# Altium project Placa.PrjPcb
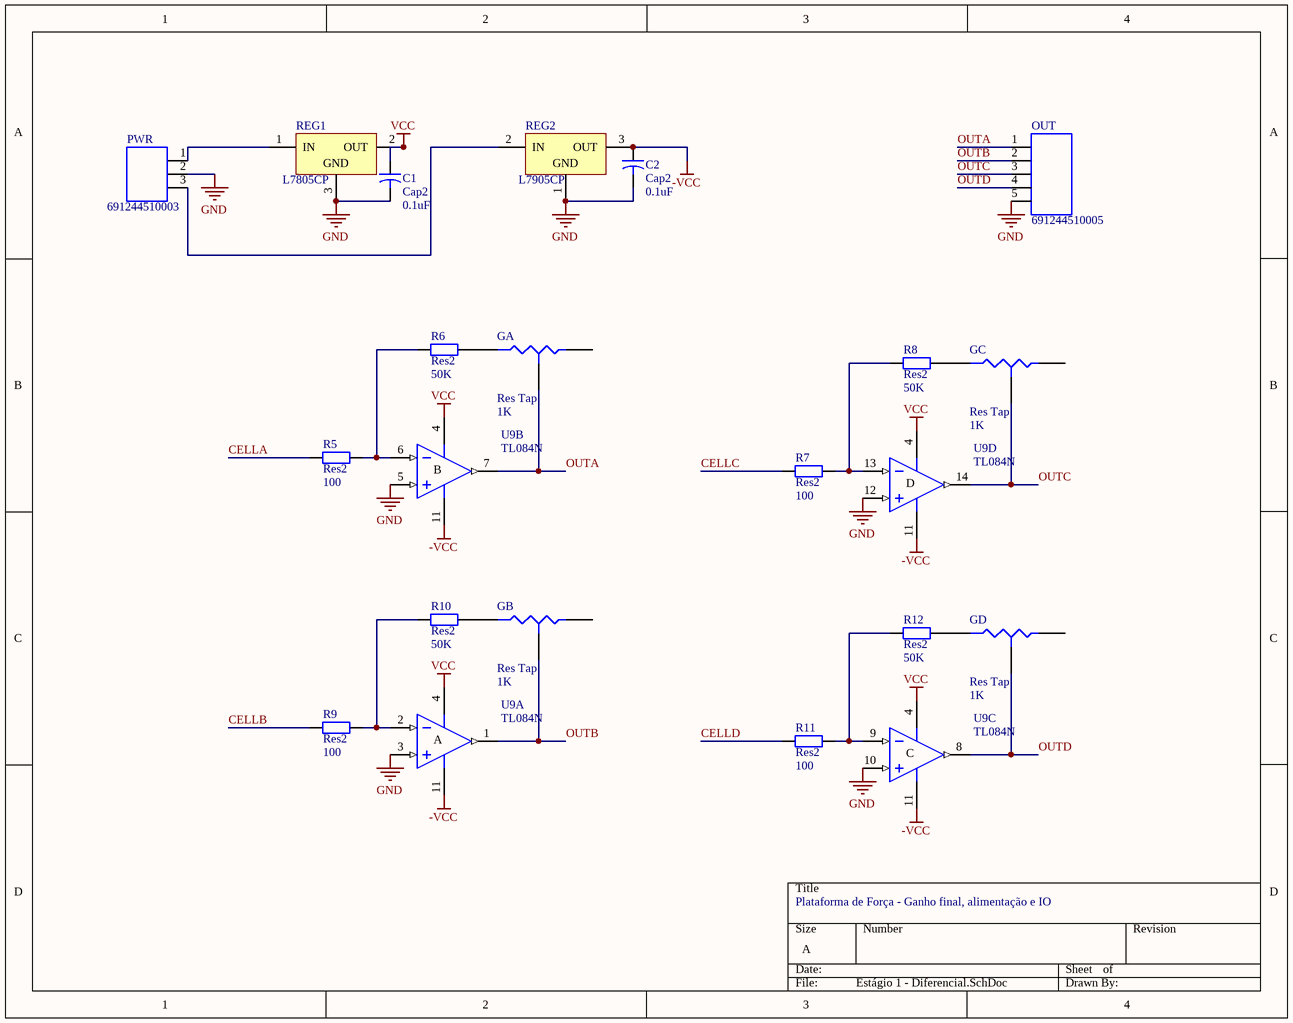
[diagram p0: Estágio 1 - Diferencial.SchDoc]
5 sheets, 43 parts. Net scope: global (net labels, ports and power ports of the same name join across sheets).
Board file: Placa.PcbDoc
Sheets:
  Estágio 1 - Diferencial.SchDoc
  Célula 1.SchDoc
  Célula 2.SchDoc
  Célula 3.SchDoc
  Célula 4.SchDoc

## Sheet Estágio 1 - Diferencial.SchDoc
size A

### Parts
C1  Cap2  value 0.1uF  [CAPR5-4X5]
C2  Cap2  value 0.1uF  [CAPR5-4X5]
GA  Res Tap  value 1K  [3296W]
GB  Res Tap  value 1K  [3296W]
GC  Res Tap  value 1K  [3296W]
GD  Res Tap  value 1K  [3296W]
OUT  691244510005  [691244510005]
PWR  691244510003  [691244510003]
R5  Res2  value 100  [AXIAL-0.4]
R6  Res2  value 50K  [AXIAL-0.4]
R7  Res2  value 100  [AXIAL-0.4]
R8  Res2  value 50K  [AXIAL-0.4]
R9  Res2  value 100  [AXIAL-0.4]
R10  Res2  value 50K  [AXIAL-0.4]
R11  Res2  value 100  [AXIAL-0.4]
R12  Res2  value 50K  [AXIAL-0.4]
REG1  L7805CP  [ISOWATT220AB]
REG2  L7905CP  [ISOWATT220AB]
U9  TL084N  [N014]  (parts A,B,C,D of 4)

### Nets
-VCC: C2.1 REG2.3(OUT) U9.11(V-)
GND: C1.2 C2.2 OUT.5 PWR.2 REG1.3(GND) REG2.1(GND) U9.3(IN+) U9.5(IN+) U9.10(IN+) U9.12(IN+)
VCC: C1.1 REG1.2(OUT) U9.4(V+)
CELLA: R5.1
CELLB: R9.1
CELLC: R7.1
CELLD: R11.1
OUTA: GA.3(TAP) OUT.1 U9.7(OUT)
OUTB: GB.3(TAP) OUT.2 U9.1(OUT)
OUTC: GC.3(TAP) OUT.3 U9.14(OUT)
OUTD: GD.3(TAP) OUT.4 U9.8(OUT)
NetGA_2: GA.2(B) R6.2
NetGB_2: GB.2(B) R10.2
NetGC_2: GC.2(B) R8.2
NetGD_2: GD.2(B) R12.2
NetPWR_1: PWR.1 REG1.1(IN)
NetPWR_3: PWR.3 REG2.2(IN)
NetR5_2: R5.2 R6.1 U9.6(IN-)
NetR7_2: R7.2 R8.1 U9.13(IN-)
NetR9_2: R9.2 R10.1 U9.2(IN-)
NetR11_2: R11.2 R12.1 U9.9(IN-)

Not connected (* = marked no-connect by the designer): GA 1(A); GB 1(A); GC 1(A); GD 1(A)

### Notes on the sheet
- Plataforma de Força - Ganho final, alimentação e IO
- (in symbol TL084N, part A) A
- (in symbol TL084N, part B) B
- (in symbol TL084N, part C) C
- (in symbol TL084N, part D) D

### Library data of the parts
C1 C2 = Cap2: Capacitor; Published: 23-Sep-2002; PackageReference: CAPR5-4X5; Publisher: Altium Limited; PackageDescription: Capacitor; 2 Leads
GA GB GC GD = Res Tap: Tapped Resistor; Sim Note: Enter the Resistance value and the set point into parameter fields.; Set Position: 0.5; Published: 24-Mar-1999; LatestRevisionDate: 17-Jul-2002; LatestRevisionNote: Re-released for DXP Platform.; PackageReference: VR3; Publisher: Altium Limited; PackageDescription: Variable Resistor, Thru-Hole; 3 Leads
OUT = 691244510005: WR-TBL Horizontal Cable Entry With Rising Cage Clamp,Serie 2445 - 5.08 mm; Manufacturer: Wurth Elektronik; ComponentLink1 Description: Manufacturer; ComponentLink2 Description: Datasheet; ComponentLink1URL: http://www.we-online.de; ComponentLink2URL: http://katalog.we-online.de/em/datasheet/6912445100XX.pdf; Created by: Baojun Chen; Created Date: 15.Sep.2015; partNo: 691244510005
PWR = 691244510003: WR-TBL Horizontal Cable Entry With Rising Cage Clamp,Serie 2445 - 5.08 mm; Manufacturer: Wurth Elektronik; ComponentLink1 Description: Manufacturer; ComponentLink2 Description: Datasheet; ComponentLink1URL: http://www.we-online.de; ComponentLink2URL: http://katalog.we-online.de/em/datasheet/6912445100XX.pdf; Created by: Baojun Chen; Created Date: 15.Sep.2015; partNo: 691244510003
R5-R12 = Res2: Resistor; Published: 8-Jun-2000; LatestRevisionDate: 17-Jul-2002; LatestRevisionNote: Re-released for DXP Platform.; PackageReference: AXIAL-0.4; Publisher: Altium Limited; PackageDescription: Axial Device, Thru-Hole; 2 Leads; 0.4 in Pin Spacing
REG1 = L7805CP: Positive Voltage Regulator; Note: Tab is connected to pin 3 (GND).; Published: 24-Aug-2001; LatestRevisionDate: 17-Jul-2002; LatestRevisionNote: Re-released for DXP Platform.; DatasheetVersion: Dec-1998; PackageVersion: Jul-1998; PackageReference: ISOWATT220AB; Publisher: Altium Limited; PackageDescription: TO, Thru-Hole, Vertical, Heatsink Mounted; 3 In-Line Leads; Pitch 2.54 mm; Pin sequence 1, 3, 2; ComponentLink1Description: Manufacturer Link; ComponentLink1URL: http://www.st.com/
REG2 = L7905CP: Negative Voltage Regulator; Note: Tab is connected to pin 3 (IN).; Published: 24-Aug-2001; LatestRevisionDate: 17-Jul-2002; LatestRevisionNote: Re-released for DXP Platform.; DatasheetVersion: Apr-1997; PackageVersion: Jul-1998; PackageReference: ISOWATT220AB; Publisher: Altium Limited; PackageDescription: TO, Thru-Hole, Vertical, Heatsink Mounted; 3 In-Line Leads; Pitch 2.54 mm; Pin sequence 1, 3, 2; ComponentLink1Description: Manufacturer Link; ComponentLink1URL: http://www.st.com/; ComponentLink2Description: Datasheet; ComponentLink2URL: http://www.st.com/stonline/products/literature/ds/2149/l7905c.pdf
U9 = TL084N: JFET-Input Operational Amplifier; Published: 16-Jan-2001; LatestRevisionDate: 04-Mar-2005; LatestRevisionNote: Stylized 3D Model Added.; DatasheetVersion: Feb-1999; PackageVersion: Oct-1995; PackageReference: N014; Publisher: Altium Limited; PackageDescription: DIP; 14 Leads; Row Spacing 7.62 mm; Pitch 2.54 mm; ComponentLink1Description: Manufacturer Link; ComponentLink1URL: http://www.ti.com/; ComponentLink2Description: Datasheet; ComponentLink2URL: http://www-s.ti.com/sc/ds/tl084.pdf

## Sheet Célula 1.SchDoc
size A
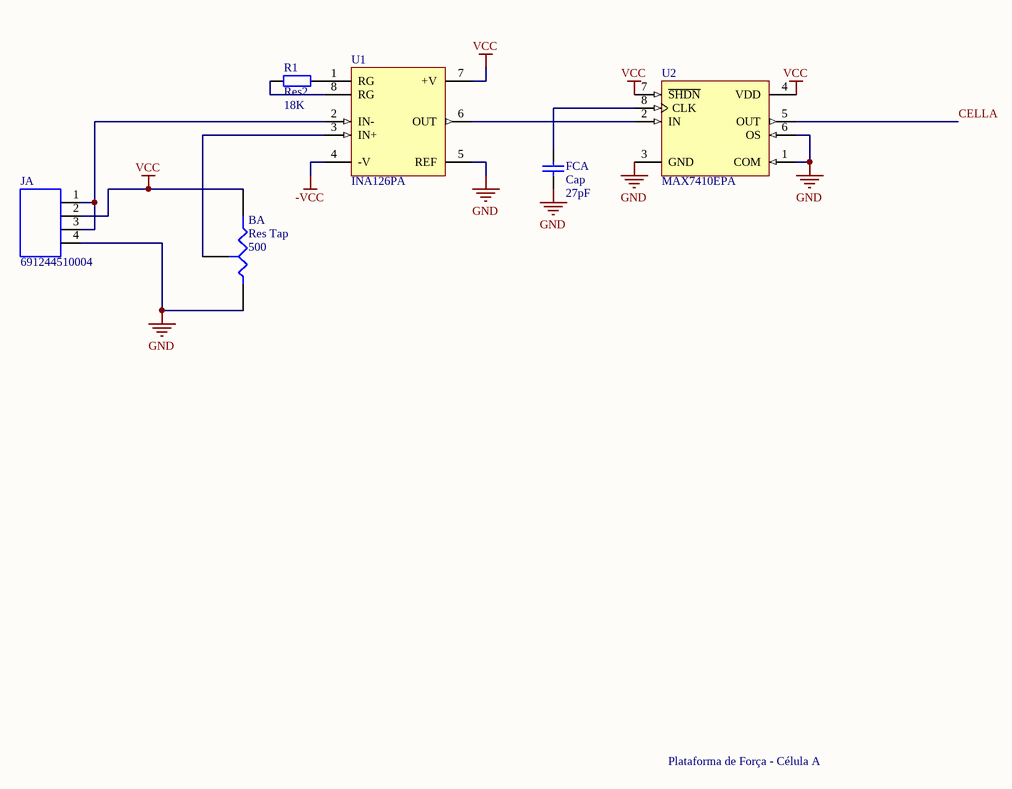
[diagram p1: Célula 1.SchDoc]

### Parts
BA  Res Tap  value 500  [TSR3006]
FCA  Cap  value 27pF  [RAD-0.3]
JA  691244510004  [691244510004]
R1  Res2  value 18K  [AXIAL-0.4]
U1  INA126PA  [006E]
U2  MAX7410EPA  [PA8]

### Nets
-VCC: U1.4(-V)
GND: BA.1(A) FCA.1 JA.4 U1.5(REF) U2.1(COM) U2.3(GND) U2.6(OS)
VCC: BA.2(B) JA.2 U1.7(+V) U2.4(VDD) U2.7(~{SHDN})
CELLA: U2.5(OUT)
NetBA_3: BA.3(TAP) U1.3(IN+)
NetFCA_2: FCA.2 U2.8(CLK)
NetJA_1: JA.1 JA.3 U1.2(IN-)
NetR1_1: R1.1 U1.8(RG)
NetR1_2: R1.2 U1.1(RG)
NetU1_6: U1.6(OUT) U2.2(IN)

### Notes on the sheet
- Plataforma de Força - Célula A

### Library data of the parts
BA = Res Tap: as GA on sheet Estágio 1 - Diferencial; Published: 24-Mar-1999; LatestRevisionDate: 17-Jul-2002; LatestRevisionNote: Re-released for DXP Platform.; PackageReference: VR3; Publisher: Altium Limited; PackageDescription: Variable Resistor, Thru-Hole; 3 Leads
FCA = Cap: Capacitor; Published: 8-Jun-2000; LatestRevisionDate: 17-Jul-2002; LatestRevisionNote: Re-released for DXP Platform.; PackageReference: RAD-0.3; Publisher: Altium Limited; PackageDescription: Radial Cap, Thru-Hole; 2 Leads; 0.3 in Pin Spacing
JA = 691244510004: WR-TBL Horizontal Cable Entry With Rising Cage Clamp,Serie 2445 - 5.08 mm; Manufacturer: Wurth Elektronik; ComponentLink1 Description: Manufacturer; ComponentLink2 Description: Datasheet; ComponentLink1URL: http://www.we-online.de; ComponentLink2URL: http://katalog.we-online.de/em/datasheet/6912445100XX.pdf; Created by: Baojun Chen; Created Date: 15.Sep.2015; partNo: 691244510004
R1 = Res2: Resistor; Published: 8-Jun-2000; LatestRevisionDate: 17-Jul-2002; LatestRevisionNote: Re-released for DXP Platform.; PackageReference: AXIAL-0.4; Publisher: Altium Limited; PackageDescription: Axial Device, Thru-Hole; 2 Leads; 0.4 in Pin Spacing
U1 = INA126PA: Precision, Low-Power Instrumentation Amplifiers; Published: 8-Jun-2000; LatestRevisionDate: 06-Jun-2005; LatestRevisionNote: Stylized 3D Model Added.; DatasheetVersion: Oct-1996; PackageVersion: revE; PackageReference: 006E; Publisher: Altium Limited; PackageDescription: DIP; 8 Leads; Row Spacing 7.62 mm; Pitch 2.54 mm; ComponentLink1Description: Manufacturer Link; ComponentLink1URL: http://www.ti.com/; ComponentLink2Description: Datasheet; ComponentLink2URL: http://www-s.ti.com/sc/ds/INA128.pdf
U2 = MAX7410EPA: 5th-Order, Lowpass, Switched-Capacitor Filter; Published: 16-Jan-2001; LatestRevisionDate: 29-May-2009; LatestRevisionNote: Component Body Added.; DatasheetVersion: Sep-1998; PackageVersion: RevB, 21-0043; PackageReference: PA8; Publisher: Altium Limited; PackageDescription: DIP, 8-Pin, Row Spacing 7.62 mm, Pitch 2.54 mm; Code_JEDEC: MS-001-AB; ComponentLink1Description: Manufacturer Link; ComponentLink1URL: http://www.maxim-ic.com/; ComponentLink2Description: Datasheet; ComponentLink2URL: http://pdfserv.maxim-ic.com/en/ds/MAX7409-MAX7414.pdf

## Sheet Célula 2.SchDoc
size A
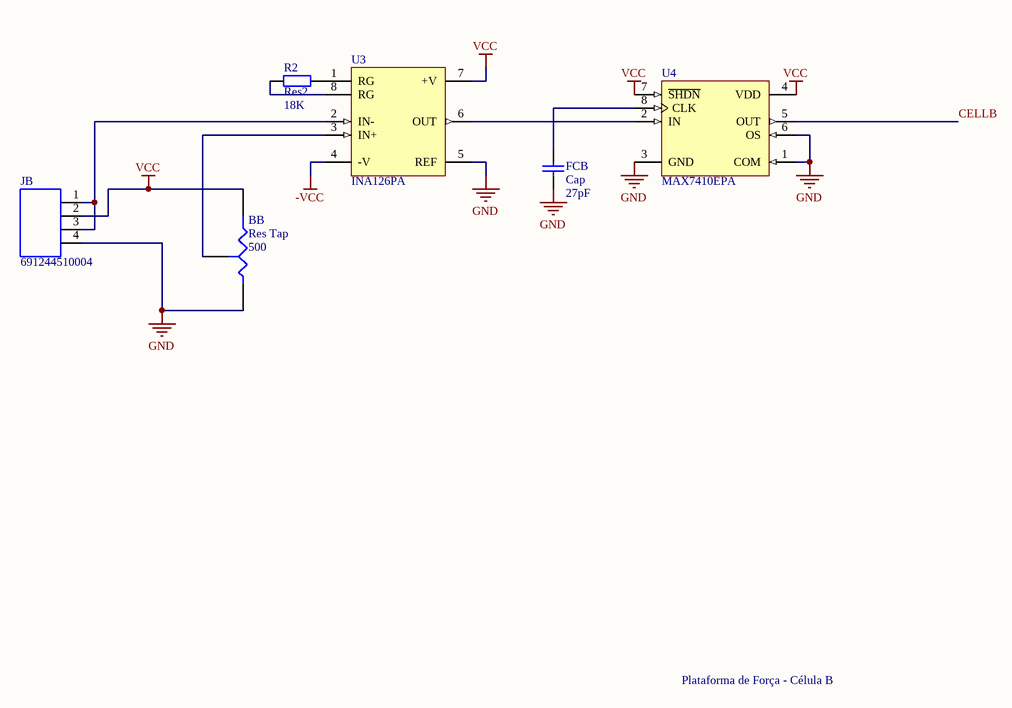
[diagram p2: Célula 2.SchDoc]

### Parts
BB  Res Tap  value 500  [TSR3006]
FCB  Cap  value 27pF  [RAD-0.3]
JB  691244510004  [691244510004]
R2  Res2  value 18K  [AXIAL-0.4]
U3  INA126PA  [006E]
U4  MAX7410EPA  [PA8]

### Nets
-VCC: U3.4(-V)
GND: BB.1(A) FCB.1 JB.4 U3.5(REF) U4.1(COM) U4.3(GND) U4.6(OS)
VCC: BB.2(B) JB.2 U3.7(+V) U4.4(VDD) U4.7(~{SHDN})
CELLB: U4.5(OUT)
NetBB_3: BB.3(TAP) U3.3(IN+)
NetFCB_2: FCB.2 U4.8(CLK)
NetJB_1: JB.1 JB.3 U3.2(IN-)
NetR2_1: R2.1 U3.8(RG)
NetR2_2: R2.2 U3.1(RG)
NetU3_6: U3.6(OUT) U4.2(IN)

### Notes on the sheet
- Plataforma de Força - Célula B

### Library data of the parts
BB = Res Tap: as GA on sheet Estágio 1 - Diferencial; Published: 24-Mar-1999; LatestRevisionDate: 17-Jul-2002; LatestRevisionNote: Re-released for DXP Platform.; PackageReference: VR3; Publisher: Altium Limited; PackageDescription: Variable Resistor, Thru-Hole; 3 Leads
FCB = Cap: Capacitor; Published: 8-Jun-2000; LatestRevisionDate: 17-Jul-2002; LatestRevisionNote: Re-released for DXP Platform.; PackageReference: RAD-0.3; Publisher: Altium Limited; PackageDescription: Radial Cap, Thru-Hole; 2 Leads; 0.3 in Pin Spacing
JB = 691244510004: as JA on sheet Célula 1; ComponentLink1URL: http://www.we-online.de; ComponentLink2URL: http://katalog.we-online.de/em/datasheet/6912445100XX.pdf; Created by: Baojun Chen; Created Date: 15.Sep.2015; partNo: 691244510004
R2 = Res2: Resistor; Published: 8-Jun-2000; LatestRevisionDate: 17-Jul-2002; LatestRevisionNote: Re-released for DXP Platform.; PackageReference: AXIAL-0.4; Publisher: Altium Limited; PackageDescription: Axial Device, Thru-Hole; 2 Leads; 0.4 in Pin Spacing
U3 = INA126PA: as U1 on sheet Célula 1; Published: 8-Jun-2000; LatestRevisionDate: 06-Jun-2005; LatestRevisionNote: Stylized 3D Model Added.; DatasheetVersion: Oct-1996; PackageVersion: revE; PackageReference: 006E; Publisher: Altium Limited; PackageDescription: DIP; 8 Leads; Row Spacing 7.62 mm; Pitch 2.54 mm; ComponentLink1Description: Manufacturer Link; ComponentLink1URL: http://www.ti.com/; ComponentLink2Description: Datasheet; ComponentLink2URL: http://www-s.ti.com/sc/ds/INA128.pdf
U4 = MAX7410EPA: as U2 on sheet Célula 1; Published: 16-Jan-2001; LatestRevisionDate: 29-May-2009; LatestRevisionNote: Component Body Added.; DatasheetVersion: Sep-1998; PackageVersion: RevB, 21-0043; PackageReference: PA8; Publisher: Altium Limited; PackageDescription: DIP, 8-Pin, Row Spacing 7.62 mm, Pitch 2.54 mm; Code_JEDEC: MS-001-AB; ComponentLink1Description: Manufacturer Link; ComponentLink1URL: http://www.maxim-ic.com/; ComponentLink2Description: Datasheet; ComponentLink2URL: http://pdfserv.maxim-ic.com/en/ds/MAX7409-MAX7414.pdf

## Sheet Célula 3.SchDoc
size A
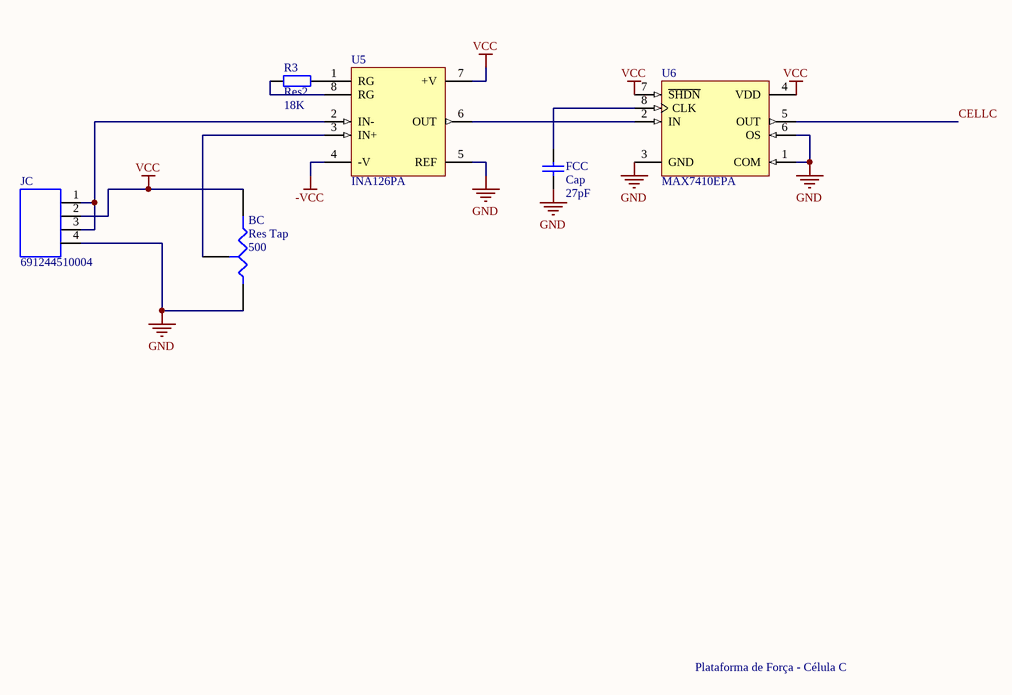
[diagram p3: Célula 3.SchDoc]

### Parts
BC  Res Tap  value 500  [TSR3006]
FCC  Cap  value 27pF  [RAD-0.3]
JC  691244510004  [691244510004]
R3  Res2  value 18K  [AXIAL-0.4]
U5  INA126PA  [006E]
U6  MAX7410EPA  [PA8]

### Nets
-VCC: U5.4(-V)
GND: BC.1(A) FCC.1 JC.4 U5.5(REF) U6.1(COM) U6.3(GND) U6.6(OS)
VCC: BC.2(B) JC.2 U5.7(+V) U6.4(VDD) U6.7(~{SHDN})
CELLC: U6.5(OUT)
NetBC_3: BC.3(TAP) U5.3(IN+)
NetFCC_2: FCC.2 U6.8(CLK)
NetJC_1: JC.1 JC.3 U5.2(IN-)
NetR3_1: R3.1 U5.8(RG)
NetR3_2: R3.2 U5.1(RG)
NetU5_6: U5.6(OUT) U6.2(IN)

### Notes on the sheet
- Plataforma de Força - Célula C

### Library data of the parts
BC = Res Tap: as GA on sheet Estágio 1 - Diferencial; Published: 24-Mar-1999; LatestRevisionDate: 17-Jul-2002; LatestRevisionNote: Re-released for DXP Platform.; PackageReference: VR3; Publisher: Altium Limited; PackageDescription: Variable Resistor, Thru-Hole; 3 Leads
FCC = Cap: Capacitor; Published: 8-Jun-2000; LatestRevisionDate: 17-Jul-2002; LatestRevisionNote: Re-released for DXP Platform.; PackageReference: RAD-0.3; Publisher: Altium Limited; PackageDescription: Radial Cap, Thru-Hole; 2 Leads; 0.3 in Pin Spacing
JC = 691244510004: as JA on sheet Célula 1; ComponentLink1URL: http://www.we-online.de; ComponentLink2URL: http://katalog.we-online.de/em/datasheet/6912445100XX.pdf; Created by: Baojun Chen; Created Date: 15.Sep.2015; partNo: 691244510004
R3 = Res2: Resistor; Published: 8-Jun-2000; LatestRevisionDate: 17-Jul-2002; LatestRevisionNote: Re-released for DXP Platform.; PackageReference: AXIAL-0.4; Publisher: Altium Limited; PackageDescription: Axial Device, Thru-Hole; 2 Leads; 0.4 in Pin Spacing
U5 = INA126PA: as U1 on sheet Célula 1; Published: 8-Jun-2000; LatestRevisionDate: 06-Jun-2005; LatestRevisionNote: Stylized 3D Model Added.; DatasheetVersion: Oct-1996; PackageVersion: revE; PackageReference: 006E; Publisher: Altium Limited; PackageDescription: DIP; 8 Leads; Row Spacing 7.62 mm; Pitch 2.54 mm; ComponentLink1Description: Manufacturer Link; ComponentLink1URL: http://www.ti.com/; ComponentLink2Description: Datasheet; ComponentLink2URL: http://www-s.ti.com/sc/ds/INA128.pdf
U6 = MAX7410EPA: as U2 on sheet Célula 1; Published: 16-Jan-2001; LatestRevisionDate: 29-May-2009; LatestRevisionNote: Component Body Added.; DatasheetVersion: Sep-1998; PackageVersion: RevB, 21-0043; PackageReference: PA8; Publisher: Altium Limited; PackageDescription: DIP, 8-Pin, Row Spacing 7.62 mm, Pitch 2.54 mm; Code_JEDEC: MS-001-AB; ComponentLink1Description: Manufacturer Link; ComponentLink1URL: http://www.maxim-ic.com/; ComponentLink2Description: Datasheet; ComponentLink2URL: http://pdfserv.maxim-ic.com/en/ds/MAX7409-MAX7414.pdf

## Sheet Célula 4.SchDoc
size A
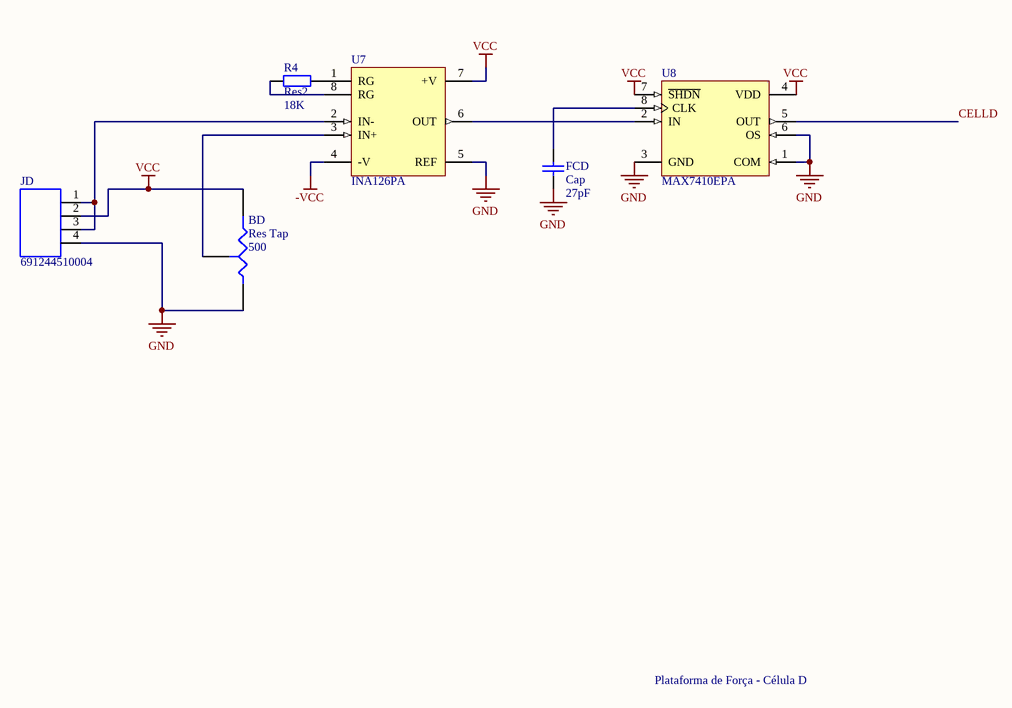
[diagram p4: Célula 4.SchDoc]

### Parts
BD  Res Tap  value 500  [TSR3006]
FCD  Cap  value 27pF  [RAD-0.3]
JD  691244510004  [691244510004]
R4  Res2  value 18K  [AXIAL-0.4]
U7  INA126PA  [006E]
U8  MAX7410EPA  [PA8]

### Nets
-VCC: U7.4(-V)
GND: BD.1(A) FCD.1 JD.4 U7.5(REF) U8.1(COM) U8.3(GND) U8.6(OS)
VCC: BD.2(B) JD.2 U7.7(+V) U8.4(VDD) U8.7(~{SHDN})
CELLD: U8.5(OUT)
NetBD_3: BD.3(TAP) U7.3(IN+)
NetFCD_2: FCD.2 U8.8(CLK)
NetJD_1: JD.1 JD.3 U7.2(IN-)
NetR4_1: R4.1 U7.8(RG)
NetR4_2: R4.2 U7.1(RG)
NetU7_6: U7.6(OUT) U8.2(IN)

### Notes on the sheet
- Plataforma de Força - Célula D

### Library data of the parts
BD = Res Tap: as GA on sheet Estágio 1 - Diferencial; Published: 24-Mar-1999; LatestRevisionDate: 17-Jul-2002; LatestRevisionNote: Re-released for DXP Platform.; PackageReference: VR3; Publisher: Altium Limited; PackageDescription: Variable Resistor, Thru-Hole; 3 Leads
FCD = Cap: Capacitor; Published: 8-Jun-2000; LatestRevisionDate: 17-Jul-2002; LatestRevisionNote: Re-released for DXP Platform.; PackageReference: RAD-0.3; Publisher: Altium Limited; PackageDescription: Radial Cap, Thru-Hole; 2 Leads; 0.3 in Pin Spacing
JD = 691244510004: as JA on sheet Célula 1; ComponentLink1URL: http://www.we-online.de; ComponentLink2URL: http://katalog.we-online.de/em/datasheet/6912445100XX.pdf; Created by: Baojun Chen; Created Date: 15.Sep.2015; partNo: 691244510004
R4 = Res2: Resistor; Published: 8-Jun-2000; LatestRevisionDate: 17-Jul-2002; LatestRevisionNote: Re-released for DXP Platform.; PackageReference: AXIAL-0.4; Publisher: Altium Limited; PackageDescription: Axial Device, Thru-Hole; 2 Leads; 0.4 in Pin Spacing
U7 = INA126PA: as U1 on sheet Célula 1; Published: 8-Jun-2000; LatestRevisionDate: 06-Jun-2005; LatestRevisionNote: Stylized 3D Model Added.; DatasheetVersion: Oct-1996; PackageVersion: revE; PackageReference: 006E; Publisher: Altium Limited; PackageDescription: DIP; 8 Leads; Row Spacing 7.62 mm; Pitch 2.54 mm; ComponentLink1Description: Manufacturer Link; ComponentLink1URL: http://www.ti.com/; ComponentLink2Description: Datasheet; ComponentLink2URL: http://www-s.ti.com/sc/ds/INA128.pdf
U8 = MAX7410EPA: as U2 on sheet Célula 1; Published: 16-Jan-2001; LatestRevisionDate: 29-May-2009; LatestRevisionNote: Component Body Added.; DatasheetVersion: Sep-1998; PackageVersion: RevB, 21-0043; PackageReference: PA8; Publisher: Altium Limited; PackageDescription: DIP, 8-Pin, Row Spacing 7.62 mm, Pitch 2.54 mm; Code_JEDEC: MS-001-AB; ComponentLink1Description: Manufacturer Link; ComponentLink1URL: http://www.maxim-ic.com/; ComponentLink2Description: Datasheet; ComponentLink2URL: http://pdfserv.maxim-ic.com/en/ds/MAX7409-MAX7414.pdf

## Nets that join several sheets
-VCC: Estágio 1 - Diferencial (C2.1 REG2.3 U9.11), Célula 1 (U1.4), Célula 2 (U3.4), Célula 3 (U5.4), Célula 4 (U7.4)
GND: Estágio 1 - Diferencial (10 pins), Célula 1 (7 pins), Célula 2 (7 pins), Célula 3 (7 pins), Célula 4 (7 pins)
VCC: Estágio 1 - Diferencial (C1.1 REG1.2 U9.4), Célula 1 (5 pins), Célula 2 (5 pins), Célula 3 (5 pins), Célula 4 (5 pins)
CELLA: Estágio 1 - Diferencial (R5.1), Célula 1 (U2.5)
CELLB: Estágio 1 - Diferencial (R9.1), Célula 2 (U4.5)
CELLC: Estágio 1 - Diferencial (R7.1), Célula 3 (U6.5)
CELLD: Estágio 1 - Diferencial (R11.1), Célula 4 (U8.5)